# Altium schematic sheet mcu.schdoc
size 209 x 297 mm; Scale: 1:1; DocumentType: Ñõåìà ýëåêòðè÷åñêàÿ ïðèíöèïèàëüíàÿ; FirstReferrence: ÀÁÂÃ.123456.001; Title1str: {Наименование}; PageSetup: Record=PageOptions¦CenterHorizontal=False¦CenterVertical=False¦PrintScale=0.95¦XCorrection=0.00¦YCorrection=0.00¦PrintKind=1¦BorderSize=5000000¦LeftOffset=0¦BottomOffset=0¦Orientation=1¦PaperLength=1000¦PaperWidth=1000¦Scale=100¦PaperSource=15¦PrintQuality=600¦MediaType=1¦DitherType=10¦PaperKind=A4¦PrintScaleMode=1; DocumentType1str: {Документ}; DocumentType2str: {Документ}
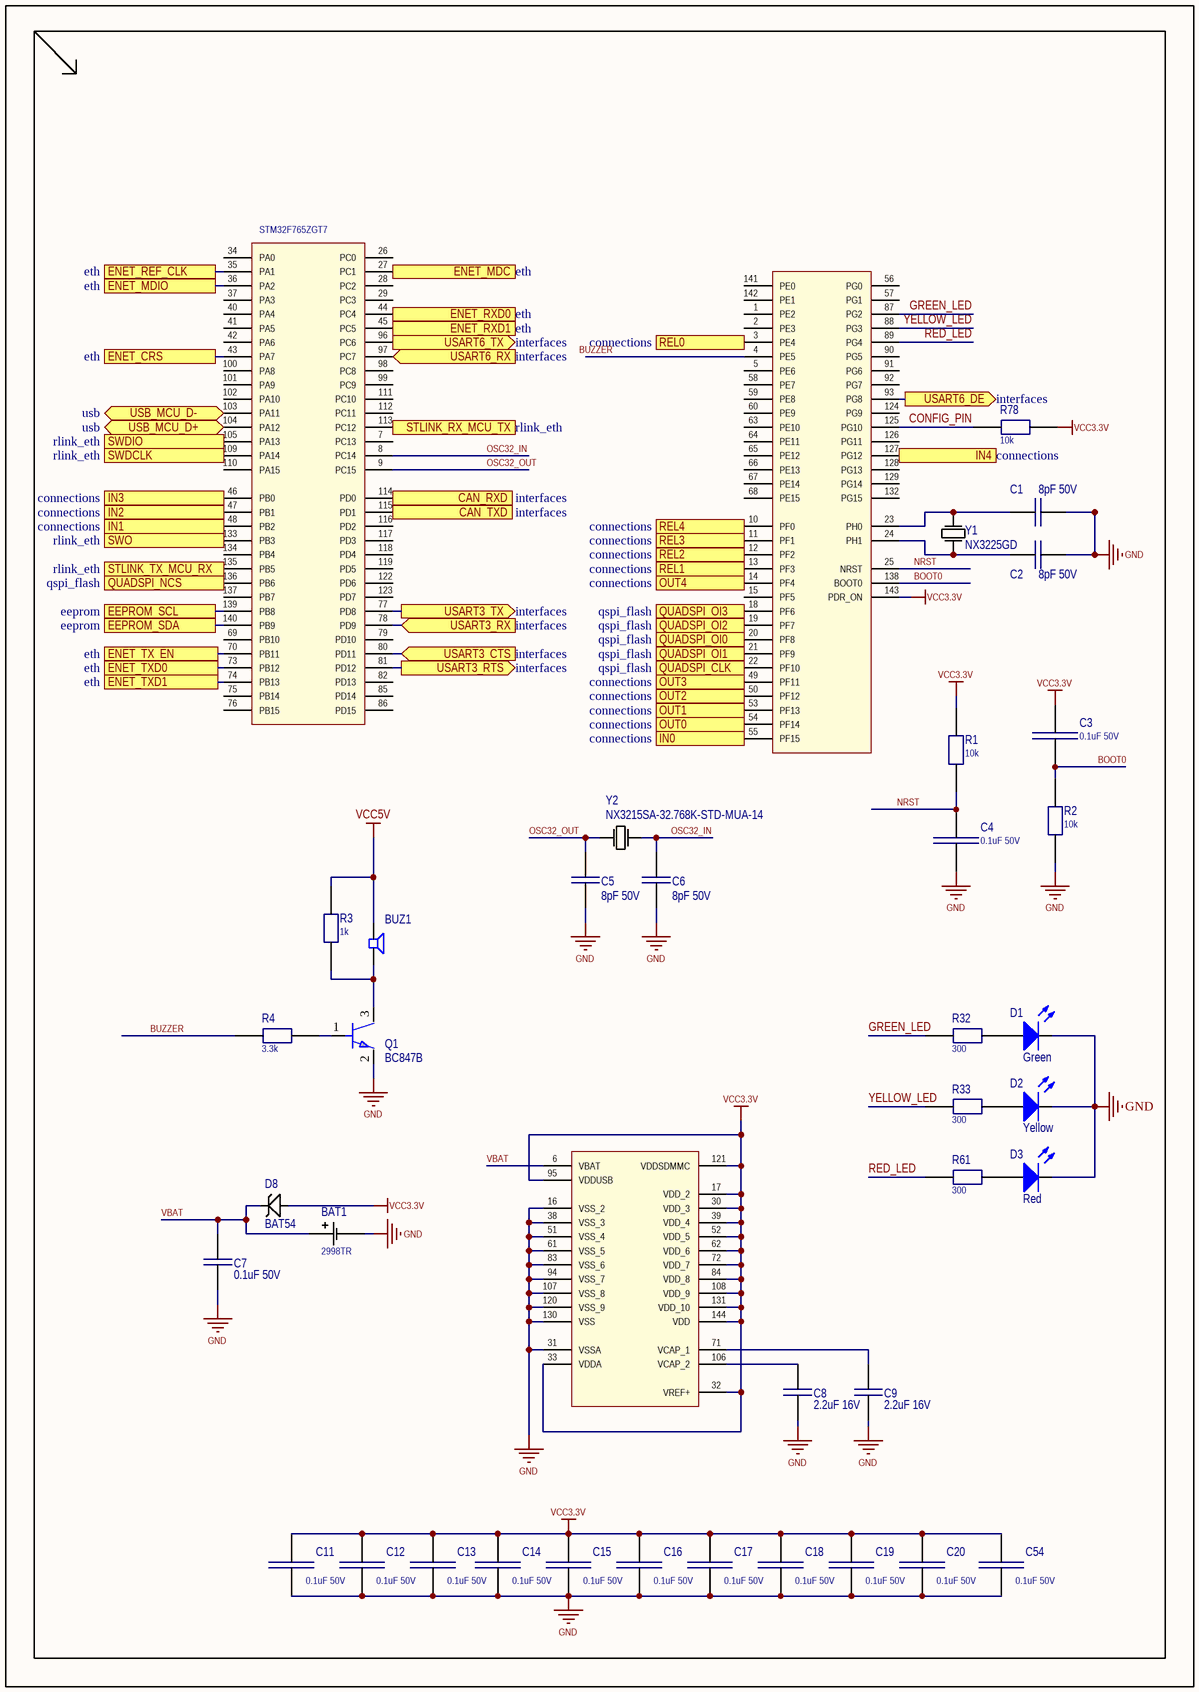
[diagram p0: mcu.schdoc]

## Parts
BAT1  2998TR  [BAT_2998TR]
BUZ1  (no value)  [SPKR_PKMCS0909E4000-R1]
C1  8pF 50V  [C_0603]
C2  8pF 50V  [C_0603]
C3  0.1uF 50V  [C_0603]
C4  0.1uF 50V  [C_0603]
C5  8pF 50V  [C_0603]
C6  8pF 50V  [C_0603]
C7  0.1uF 50V  [C_0603]
C8  2.2uF 16V  [C_0603]
C9  2.2uF 16V  [C_0603]
C11  0.1uF 50V  [C_0603]
C12  0.1uF 50V  [C_0603]
C13  0.1uF 50V  [C_0603]
C14  0.1uF 50V  [C_0603]
C15  0.1uF 50V  [C_0603]
C16  0.1uF 50V  [C_0603]
C17  0.1uF 50V  [C_0603]
C18  0.1uF 50V  [C_0603]
C19  0.1uF 50V  [C_0603]
C20  0.1uF 50V  [C_0603]
C54  0.1uF 50V  [C_0603]
D1  Green  [LED_0603]
D2  Yellow  [LED_0603]
D3  Red  [LED_0603]
D8  BAT54  [SOT23]
Q1  BC847B  [SOT23]
R1  10k  [R_0603]
R2  10k  [R_0603]
R3  1k  [R_0603]
R4  3.3k  [R_0603]
R32  300  [R_0603]
R33  300  [R_0603]
R61  300  [R_0603]
R78  10k  [R_0603]
U1  STM32F765ZGT7  [TQFP144_M]  (parts A,B,C of 3)
Y1  NX3225GD  [NX3225GD]
Y2  NX3215SA-32.768K-STD-MUA-14  [XTAL_NX3215SA-32.768K-STD-MUA-8]

## Ports
CAN_RXD (in, see interfaces), CAN_TXD (out, see interfaces), EEPROM_SCL (see eeprom), EEPROM_SDA (see eeprom), ENET_CRS (see eth), ENET_MDC (see eth), ENET_MDIO (see eth), ENET_REF_CLK (see eth), ENET_RXD0 (see eth), ENET_RXD1 (see eth), ENET_TX_EN (see eth), ENET_TXD0 (see eth), ENET_TXD1 (see eth), IN0 (in, see connections), IN1 (in, see connections), IN2 (in, see connections), IN3 (in, see connections), IN4 (in, see connections), OUT0 (out, see connections), OUT1 (out, see connections), OUT2 (out, see connections), OUT3 (out, see connections), OUT4 (out, see connections), QUADSPI_CLK (see qspi_flash), QUADSPI_NCS (see qspi_flash), QUADSPI_OI0 (see qspi_flash), QUADSPI_OI1 (see qspi_flash), QUADSPI_OI2 (see qspi_flash), QUADSPI_OI3 (see qspi_flash), REL0 (out, see connections), REL1 (out, see connections), REL2 (out, see connections), REL3 (out, see connections), REL4 (out, see connections), STLINK_RX_MCU_TX (see rlink_eth), STLINK_TX_MCU_RX (see rlink_eth), SWDCLK (see rlink_eth), SWDIO (see rlink_eth), SWO (see rlink_eth), USART3_CTS (in, see interfaces), USART3_RTS (out, see interfaces), USART3_RX (in, see interfaces), USART3_TX (out, see interfaces), USART6_DE (out, see interfaces), USART6_RX (in, see interfaces), USART6_TX (out, see interfaces), USB_MCU_D+ (bidir, see usb), USB_MCU_D- (bidir, see usb)

## Nets
GND: BAT1.N(-) C1.1 C2.1 C4.1 C5.1 C6.1 C7.1 C8.1 C9.1 C11.1 C12.1 C13.1 C14.1 C15.1 C16.1 C17.1 C18.1 C19.1 C20.1 C54.1 D1.2(K) D2.2(K) D3.2(K) Q1.2 R2.1 U1.16(VSS_2) U1.31(VSSA) U1.38(VSS_3) U1.51(VSS_4) U1.61(VSS_5) U1.83(VSS_6) U1.94(VSS_7) U1.107(VSS_8) U1.120(VSS_9) U1.130(VSS)
VCC3.3V: C3.1 C11.2 C12.2 C13.2 C14.2 C15.2 C16.2 C17.2 C18.2 C19.2 C20.2 C54.2 D8.1 R1.2 R78.2 U1.17(VDD_2) U1.30(VDD_3) U1.32(VREF+) U1.33(VDDA) U1.39(VDD_4) U1.52(VDD_5) U1.62(VDD_6) U1.72(VDD_7) U1.84(VDD_8) U1.95(VDDUSB) U1.108(VDD_9) U1.121(VDDSDMMC) U1.131(VDD_10) U1.143(PDR_ON) U1.144(VDD)
VCC5V: BUZ1.1 R3.2
BOOT0: C3.2 R2.2 U1.138(BOOT0)
BUZZER: R4.1 U1.4(PE5)
CAN_RXD: U1.114(PD0) ; port CAN_RXD
CAN_TXD: U1.115(PD1) ; port CAN_TXD
CONFIG_PIN: R78.1 U1.125(PG10)
EEPROM_SCL: U1.139(PB8) ; port EEPROM_SCL
EEPROM_SDA: U1.140(PB9) ; port EEPROM_SDA
ENET_CRS: U1.43(PA7) ; port ENET_CRS
ENET_MDC: U1.27(PC1) ; port ENET_MDC
ENET_MDIO: U1.36(PA2) ; port ENET_MDIO
ENET_REF_CLK: U1.35(PA1) ; port ENET_REF_CLK
ENET_RXD0: U1.44(PC4) ; port ENET_RXD0
ENET_RXD1: U1.45(PC5) ; port ENET_RXD1
ENET_TX_EN: U1.70(PB11) ; port ENET_TX_EN
ENET_TXD0: U1.73(PB12) ; port ENET_TXD0
ENET_TXD1: U1.74(PB13) ; port ENET_TXD1
GREEN_LED: R32.2 U1.87(PG2)
IN0: U1.55(PF15) ; port IN0
IN1: U1.48(PB2) ; port IN1
IN2: U1.47(PB1) ; port IN2
IN3: U1.46(PB0) ; port IN3
IN4: U1.127(PG12) ; port IN4
NRST: C4.2 R1.1 U1.25(NRST)
OSC32_IN: C6.2 U1.8(PC14) Y2.2(OSC2)
OSC32_OUT: C5.2 U1.9(PC15) Y2.1(OSC1)
OUT0: U1.54(PF14) ; port OUT0
OUT1: U1.53(PF13) ; port OUT1
OUT2: U1.50(PF12) ; port OUT2
OUT3: U1.49(PF11) ; port OUT3
OUT4: U1.14(PF4) ; port OUT4
QUADSPI_CLK: U1.22(PF10) ; port QUADSPI_CLK
QUADSPI_NCS: U1.136(PB6) ; port QUADSPI_NCS
QUADSPI_OI0: U1.20(PF8) ; port QUADSPI_OI0
QUADSPI_OI1: U1.21(PF9) ; port QUADSPI_OI1
QUADSPI_OI2: U1.19(PF7) ; port QUADSPI_OI2
QUADSPI_OI3: U1.18(PF6) ; port QUADSPI_OI3
RED_LED: R61.2 U1.89(PG4)
REL0: U1.3(PE4) ; port REL0
REL1: U1.13(PF3) ; port REL1
REL2: U1.12(PF2) ; port REL2
REL3: U1.11(PF1) ; port REL3
REL4: U1.10(PF0) ; port REL4
STLINK_RX_MCU_TX: U1.113(PC12) ; port STLINK_RX_MCU_TX
STLINK_TX_MCU_RX: U1.135(PB5) ; port STLINK_TX_MCU_RX
SWDCLK: U1.109(PA14) ; port SWDCLK
SWDIO: U1.105(PA13) ; port SWDIO
SWO: U1.133(PB3) ; port SWO
USART3_CTS: U1.80(PD11) ; port USART3_CTS
USART3_RTS: U1.81(PD12) ; port USART3_RTS
USART3_RX: U1.78(PD9) ; port USART3_RX
USART3_TX: U1.77(PD8) ; port USART3_TX
USART6_DE: U1.93(PG8) ; port USART6_DE
USART6_RX: U1.97(PC7) ; port USART6_RX
USART6_TX: U1.96(PC6) ; port USART6_TX
USB_MCU_D+: U1.104(PA12) ; port USB_MCU_D+
USB_MCU_D-: U1.103(PA11) ; port USB_MCU_D-
VBAT: BAT1.P1(+) C7.2 D8.3 U1.6(VBAT)
YELLOW_LED: R33.2 U1.88(PG3)
NetBUZ1_2: BUZ1.2 Q1.3 R3.1
NetC1_2: C1.2 U1.23(PH0) Y1.2(OSC2)
NetC2_2: C2.2 U1.24(PH1) Y1.1(OSC1)
NetC8_2: C8.2 U1.106(VCAP_2)
NetC9_2: C9.2 U1.71(VCAP_1)
NetD1_1: D1.1(A) R32.1
NetD2_1: D2.1(A) R33.1
NetD3_1: D3.1(A) R61.1
NetQ1_1: Q1.1 R4.2

Not connected (* = marked no-connect by the designer): U1 1(PE2) 2(PE3) 5(PE6) 7(PC13) 15(PF5) 26(PC0) 28(PC2) 29(PC3) 34(PA0) 37(PA3) 40(PA4) 41(PA5) 42(PA6) 56(PG0) 57(PG1) 58(PE7) 59(PE8) 60(PE9) 63(PE10) 64(PE11) 65(PE12) 66(PE13) 67(PE14) 68(PE15) 69(PB10) 75(PB14) 76(PB15) 79(PD10) 82(PD13) 85(PD14) 86(PD15) 90(PG5) 91(PG6) 92(PG7) 98(PC8) 99(PC9) 100(PA8) 101(PA9) 102(PA10) 110(PA15) 111(PC10) 112(PC11) 116(PD2) 117(PD3) 118(PD4) 119(PD5) 122(PD6) 123(PD7) 124(PG9) 126(PG11) 128(PG13) 129(PG14) 132(PG15) 134(PB4) 137(PB7) 141(PE0) 142(PE1)

## Library data of the parts
BAT1 = 2998TR: Battery; Part: 2998TR; JLCPCB Part: C6078169
BUZ1 = BUZZER: Piezoelectric Sounders; Part: L-KLS3-SMT-09X1.8; Alternative Part: PKMCS0909E4000-R1; JLCPCB Part: C910763
C1 C2 C5 C6 = CAP_SMD: Capacitor; Part: CC0603DRNPO9BN8R0; Alternative Part: *; Value: 8pF 50V; JLCPCB Part: C326970
C3 C4 C11-C20 C54 = C0603: Capacitor; Part: CC0603KPX7R9BB104; Value: 0.1uF 50V; JLCPCB Part: C14663
C7 = CAP_SMD: Capacitor; Part: CC0603KPX7R9BB104; Alternative Part: *; Value: 0.1uF 50V; JLCPCB Part: C14663
C8 C9 = CAP_SMD: Capacitor; Part: CC0603KRX5R7BB225; Alternative Part: *; Value: 2.2uF 16V; JLCPCB Part: C106853
D1-D3 = LED_SMT_0603: LED; Part: FYLS-0603PGC; Alternative Part: KP-1608CGCK; Value: *
  D1: Color: Green; JLCPCB Part: C2994781
  D2: Color: Yellow; JLCPCB Part: C72038
  D3: Color: Red; JLCPCB Part: C2986060
D8 = BAT54: Diode; Part: BAT54; JLCPCB Part: C408389
Q1 = BC847B: Transistor; Part: BC847B; JLCPCB Part: C181140
R1 R2 R78 = RES_SMD: Resistor; Part: RC0603JR-0710KL; Alternative Part: *; Value: 10k; JLCPCB Part: C99198
R3 = RES_SMD: Resistor; Part: RC0603FR-071KL; Alternative Part: *; Value: 1k; JLCPCB Part: C22548
R4 = RES_SMD: Resistor; Part: RC0603FR-073K3L; Alternative Part: *; Value: 3.3k; JLCPCB Part: C108078
R32 R33 R61 = R0603: Resistor; Part: RC0603FR-07300RL; Value: 300; JLCPCB Part: C114617
U1 = STM32F76XZXT: Microcontroller; C: Copyright (C) 2016 Accelerated Designs. All rights reserved; Vendor: STMicroelectronics; Value: STM32F765ZGT7; Manufacturer_Part_Number: STM32F76XZXT; Copyright: Copyright (C) 2016 Accelerated Designs. All rights reserved; Part: STM32F765ZGT; JLCPCB Part: C1337348
Y1 = NX3225GD: Crystal Oscillator; Part: NX3225GD-8MHZ-STD-CRA-3; Alternative Part: *; JLCPCB Part: C889706
Y2 = NX3215SA-32.768K: Crystal Oscillator; Part: NX3215SA-32.768K-STD-MUA-14; Alternative Part: *; JLCPCB Part: C156244